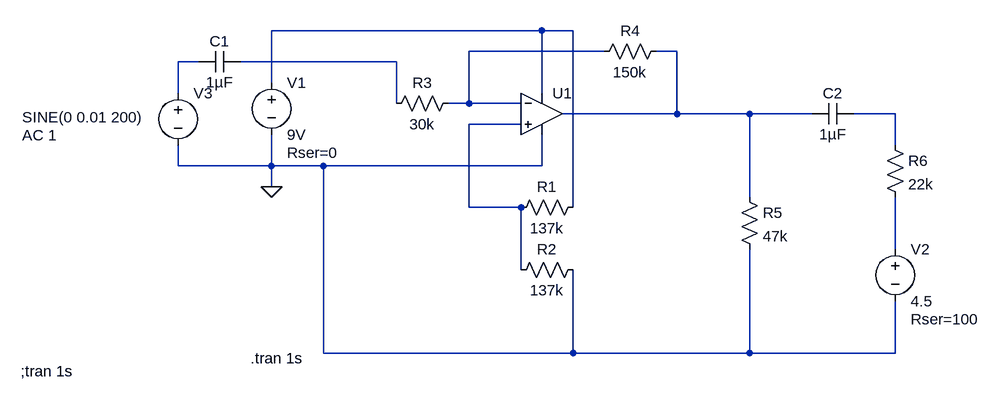
[diagram p0: schematic Preamp_Simulation.asc]
Preamp_Simulation.asc, the LTspice schematic file:
Version 4
SHEET 1 1168 680
WIRE 208 32 -208 32
WIRE 256 32 208 32
WIRE 304 64 96 64
WIRE 416 64 384 64
WIRE -320 80 -352 80
WIRE -16 80 -256 80
WIRE -208 112 -208 32
WIRE -352 128 -352 80
WIRE 208 128 208 32
WIRE -16 144 -16 80
WIRE 96 144 96 64
WIRE 96 144 64 144
WIRE 176 144 96 144
WIRE 416 160 416 64
WIRE 416 160 240 160
WIRE 528 160 416 160
WIRE 624 160 528 160
WIRE 752 160 688 160
WIRE 176 176 96 176
WIRE 752 208 752 160
WIRE -352 240 -352 208
WIRE -208 240 -208 192
WIRE -208 240 -352 240
WIRE -128 240 -208 240
WIRE 208 240 208 192
WIRE 208 240 -128 240
WIRE -208 272 -208 240
WIRE 528 288 528 160
WIRE 96 304 96 176
WIRE 176 304 96 304
WIRE 256 304 256 32
WIRE 752 368 752 288
WIRE 176 400 176 304
WIRE -128 528 -128 240
WIRE 256 528 256 400
WIRE 256 528 -128 528
WIRE 528 528 528 368
WIRE 528 528 256 528
WIRE 752 528 752 448
WIRE 752 528 528 528
FLAG -208 272 0
SYMBOL voltage -208 96 R0
WINDOW 123 0 0 Left 2
WINDOW 39 24 124 Left 2
SYMATTR SpiceLine Rser=0
SYMATTR InstName V1
SYMATTR Value 9V
SYMBOL res 272 288 R90
WINDOW 0 0 56 VBottom 2
WINDOW 3 32 56 VTop 2
SYMATTR InstName R1
SYMATTR Value 137k
SYMBOL res 272 384 R90
WINDOW 0 0 56 VBottom 2
WINDOW 3 32 56 VTop 2
SYMATTR InstName R2
SYMATTR Value 137k
SYMBOL res 80 128 R90
WINDOW 0 0 56 VBottom 2
WINDOW 3 32 56 VTop 2
SYMATTR InstName R3
SYMATTR Value 30k
SYMBOL res 400 48 R90
WINDOW 0 0 56 VBottom 2
WINDOW 3 32 56 VTop 2
SYMATTR InstName R4
SYMATTR Value 150k
SYMBOL Opamps\\UniversalOpamp2 208 160 R0
SYMATTR InstName U1
SYMBOL res 512 272 R0
SYMATTR InstName R5
SYMATTR Value 47k
SYMBOL cap -256 64 R90
WINDOW 0 0 32 VBottom 2
WINDOW 3 32 32 VTop 2
SYMATTR InstName C1
SYMATTR Value 1µF
SYMBOL voltage -352 112 R0
WINDOW 123 -240 81 Left 2
WINDOW 39 0 0 Left 2
WINDOW 3 -240 53 Left 2
SYMATTR Value2 AC 1
SYMATTR InstName V3
SYMATTR Value SINE(0 0.01 200)
SYMBOL res 736 192 R0
SYMATTR InstName R6
SYMATTR Value 22k
SYMBOL cap 688 144 R90
WINDOW 0 0 32 VBottom 2
WINDOW 3 32 32 VTop 2
SYMATTR InstName C2
SYMATTR Value 1µF
SYMBOL voltage 752 352 R0
WINDOW 123 0 0 Left 2
WINDOW 39 24 124 Left 2
SYMATTR InstName V2
SYMATTR Value 4.5
SYMATTR SpiceLine Rser=100
TEXT -240 536 Left 2 !.tran 1s
TEXT -594 556 Left 2 !;tran 1s

The netlist it stands for:
* Preamp_Simulation.asc
V1 N001 0 9V Rser=0
R1 N001 N007 137k
R2 0 N007 137k
R3 N002 N005 30k
R4 N003 N002 150k
XU1 N007 N002 N001 0 N003 level.2 Avol=1Meg GBW=10Meg Slew=10Meg ilimit=25m rail=0 Vos=0 phimargin=45 en=0 enk=0 in=0 ink=0 Rin=500Meg  ; pins IN+ IN- V+ V- OUT
R5 N003 0 47k
C1 N005 N004 1µF
V3 N004 0 SINE(0 0.01 200) AC 1
R6 N006 N008 22k
C2 N006 N003 1µF
V2 N008 0 4.5 Rser=100
.tran 1s
;tran 1s
.lib UniversalOpamps2.sub
.backanno
.end